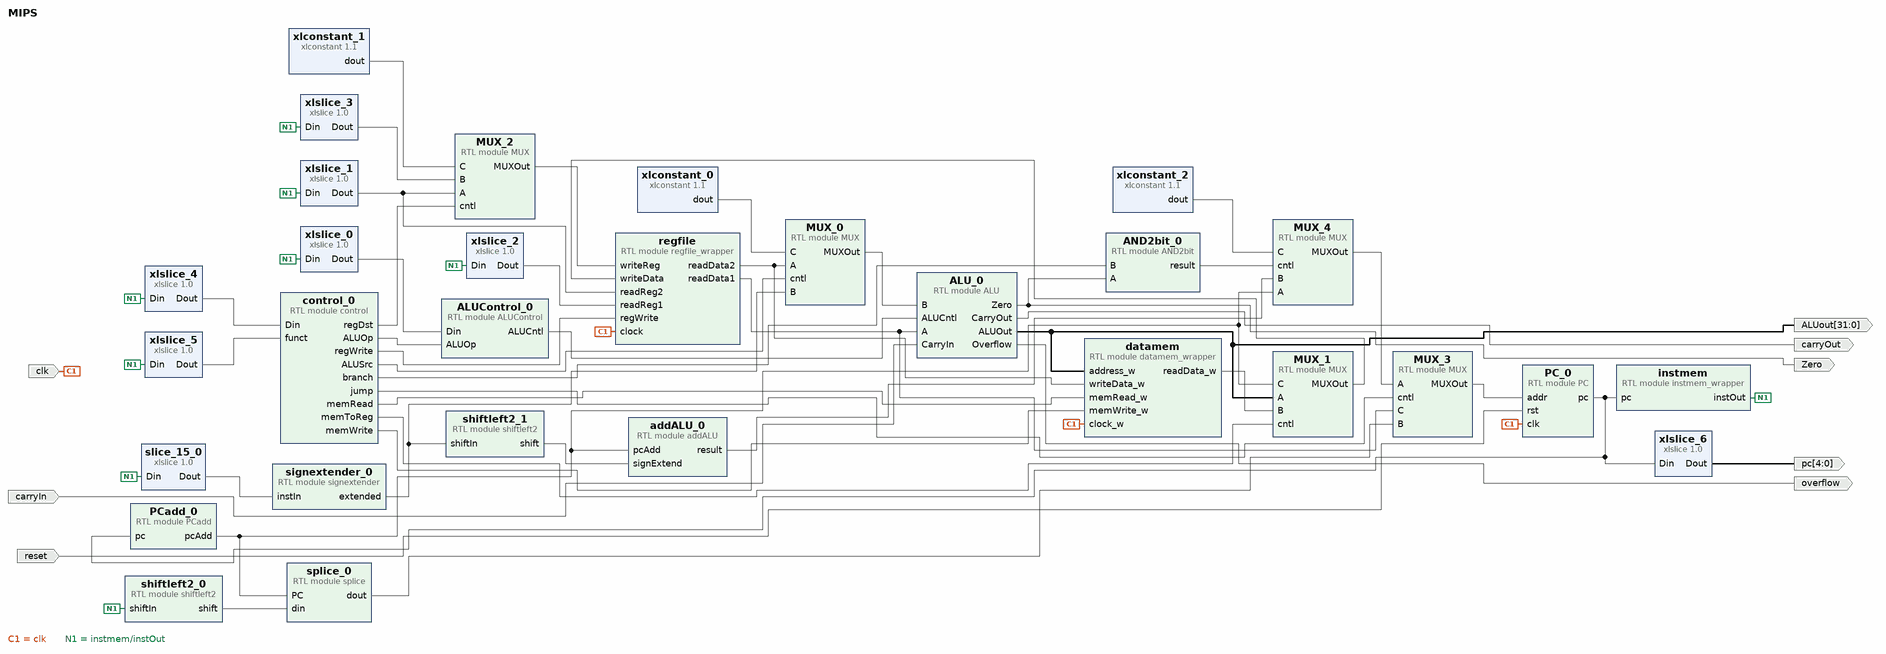
[diagram p0: block diagram of the top level]
# Vivado block design MIPS, xc7a35tcpg236-1, Vivado 2019.2
create_bd_design MIPS

create_bd_port -dir O -from 31 -to 0 ALUout
create_bd_port -dir O Zero
create_bd_port -dir I carryIn
create_bd_port -dir O carryOut
create_bd_port -dir I clk
create_bd_port -dir O overflow
create_bd_port -dir O -from 4 -to 0 pc
create_bd_port -dir I reset

create_bd_cell -type module -reference ALUControl ALUControl_0
create_bd_cell -type module -reference ALU ALU_0
create_bd_cell -type module -reference AND2bit AND2bit_0
create_bd_cell -type module -reference MUX MUX_0
create_bd_cell -type module -reference MUX MUX_1
create_bd_cell -type module -reference MUX MUX_2
set_property -dict {CONFIG.BUS_WIDTH 5} [get_bd_cells MUX_2]
create_bd_cell -type module -reference MUX MUX_3
create_bd_cell -type module -reference MUX MUX_4
create_bd_cell -type module -reference PC PC_0
create_bd_cell -type module -reference PCadd PCadd_0
create_bd_cell -type module -reference addALU addALU_0
create_bd_cell -type module -reference control control_0
create_bd_cell -type module -reference instmem_wrapper instmem
create_bd_cell -type module -reference regfile_wrapper regfile
create_bd_cell -type module -reference shiftleft2 shiftleft2_0
create_bd_cell -type module -reference shiftleft2 shiftleft2_1
create_bd_cell -type module -reference signextender signextender_0
create_bd_cell -type ip -vlnv xilinx.com:ip:xlslice:1.0 slice_15_0
set_property -dict {CONFIG.DIN_FROM 15 CONFIG.DOUT_WIDTH 16} [get_bd_cells slice_15_0]
create_bd_cell -type module -reference splice splice_0
create_bd_cell -type ip -vlnv xilinx.com:ip:xlconstant:1.1 xlconstant_0
set_property -dict {CONFIG.CONST_VAL 0 CONFIG.CONST_WIDTH 32} [get_bd_cells xlconstant_0]
create_bd_cell -type ip -vlnv xilinx.com:ip:xlconstant:1.1 xlconstant_1
set_property -dict {CONFIG.CONST_VAL 31 CONFIG.CONST_WIDTH 5} [get_bd_cells xlconstant_1]
create_bd_cell -type ip -vlnv xilinx.com:ip:xlconstant:1.1 xlconstant_2
set_property -dict {CONFIG.CONST_VAL 0 CONFIG.CONST_WIDTH 32} [get_bd_cells xlconstant_2]
create_bd_cell -type ip -vlnv xilinx.com:ip:xlslice:1.0 xlslice_0
set_property -dict {CONFIG.DIN_FROM 5 CONFIG.DOUT_WIDTH 6} [get_bd_cells xlslice_0]
create_bd_cell -type ip -vlnv xilinx.com:ip:xlslice:1.0 xlslice_1
set_property -dict {CONFIG.DIN_FROM 20 CONFIG.DIN_TO 16 CONFIG.DOUT_WIDTH 5} [get_bd_cells xlslice_1]
create_bd_cell -type ip -vlnv xilinx.com:ip:xlslice:1.0 xlslice_2
set_property -dict {CONFIG.DIN_FROM 25 CONFIG.DIN_TO 21 CONFIG.DOUT_WIDTH 5} [get_bd_cells xlslice_2]
create_bd_cell -type ip -vlnv xilinx.com:ip:xlslice:1.0 xlslice_3
set_property -dict {CONFIG.DIN_FROM 15 CONFIG.DIN_TO 11 CONFIG.DOUT_WIDTH 5} [get_bd_cells xlslice_3]
create_bd_cell -type ip -vlnv xilinx.com:ip:xlslice:1.0 xlslice_4
set_property -dict {CONFIG.DIN_FROM 31 CONFIG.DIN_TO 26 CONFIG.DOUT_WIDTH 6} [get_bd_cells xlslice_4]
create_bd_cell -type ip -vlnv xilinx.com:ip:xlslice:1.0 xlslice_5
set_property -dict {CONFIG.DIN_FROM 5 CONFIG.DOUT_WIDTH 6} [get_bd_cells xlslice_5]
create_bd_cell -type ip -vlnv xilinx.com:ip:xlslice:1.0 xlslice_6
set_property -dict {CONFIG.DIN_FROM 6 CONFIG.DIN_TO 2 CONFIG.DOUT_WIDTH 5} [get_bd_cells xlslice_6]
create_bd_cell -type module -reference datamem_wrapper datamem

# ---- connections ----

connect_bd_net [get_bd_pins ALUControl_0/ALUCntl] [get_bd_pins ALU_0/ALUCntl]
connect_bd_net [get_bd_pins ALU_0/ALUOut] [get_bd_ports ALUout] [get_bd_pins MUX_1/A] [get_bd_pins datamem/address_w]
connect_bd_net [get_bd_pins ALU_0/CarryOut] [get_bd_ports carryOut]
connect_bd_net [get_bd_pins ALU_0/Overflow] [get_bd_ports overflow]
connect_bd_net [get_bd_pins ALU_0/Zero] [get_bd_ports Zero] [get_bd_pins AND2bit_0/A]
connect_bd_net [get_bd_pins AND2bit_0/result] [get_bd_pins MUX_4/cntl]
connect_bd_net [get_bd_pins MUX_0/MUXOut] [get_bd_pins ALU_0/B]
connect_bd_net [get_bd_pins MUX_1/MUXOut] [get_bd_pins regfile/writeData]
connect_bd_net [get_bd_pins MUX_2/MUXOut] [get_bd_pins regfile/writeReg]
connect_bd_net [get_bd_pins MUX_3/MUXOut] [get_bd_pins PC_0/addr]
connect_bd_net [get_bd_pins MUX_4/MUXOut] [get_bd_pins MUX_3/A]
connect_bd_net [get_bd_pins PC_0/pc] [get_bd_pins instmem/pc] [get_bd_pins PCadd_0/pc] [get_bd_pins xlslice_6/Din]
connect_bd_net [get_bd_pins PCadd_0/pcAdd] [get_bd_pins MUX_1/C] [get_bd_pins splice_0/PC] [get_bd_pins MUX_4/A] [get_bd_pins addALU_0/pcAdd]
connect_bd_net [get_bd_pins addALU_0/result] [get_bd_pins MUX_4/B]
connect_bd_net [get_bd_ports carryIn] [get_bd_pins ALU_0/CarryIn]
connect_bd_net [get_bd_ports clk] [get_bd_pins regfile/clock] [get_bd_pins PC_0/clk] [get_bd_pins datamem/clock_w]
connect_bd_net [get_bd_pins control_0/ALUOp] [get_bd_pins ALUControl_0/ALUOp]
connect_bd_net [get_bd_pins control_0/ALUSrc] [get_bd_pins MUX_0/cntl]
connect_bd_net [get_bd_pins control_0/branch] [get_bd_pins AND2bit_0/B]
connect_bd_net [get_bd_pins control_0/jump] [get_bd_pins MUX_3/cntl]
connect_bd_net [get_bd_pins control_0/memRead] [get_bd_pins datamem/memRead_w]
connect_bd_net [get_bd_pins control_0/memToReg] [get_bd_pins MUX_1/cntl]
connect_bd_net [get_bd_pins control_0/memWrite] [get_bd_pins datamem/memWrite_w]
connect_bd_net [get_bd_pins control_0/regDst] [get_bd_pins MUX_2/cntl]
connect_bd_net [get_bd_pins control_0/regWrite] [get_bd_pins regfile/regWrite]
connect_bd_net -net datamem_wrapper_0_readData_w [get_bd_pins datamem/readData_w] [get_bd_pins MUX_1/B]
connect_bd_net -net instmem_wrapper_0_instOut [get_bd_pins instmem/instOut] \
  [get_bd_pins xlslice_0/Din] [get_bd_pins xlslice_1/Din] [get_bd_pins xlslice_2/Din] [get_bd_pins xlslice_3/Din] \
  [get_bd_pins xlslice_4/Din] [get_bd_pins xlslice_5/Din] [get_bd_pins slice_15_0/Din] [get_bd_pins shiftleft2_0/shiftIn]
connect_bd_net -net regfile_wrapper_0_readData1 [get_bd_pins regfile/readData1] [get_bd_pins ALU_0/A] [get_bd_pins MUX_3/C]
connect_bd_net -net regfile_wrapper_0_readData2 [get_bd_pins regfile/readData2] [get_bd_pins MUX_0/A] [get_bd_pins datamem/writeData_w]
connect_bd_net [get_bd_ports reset] [get_bd_pins PC_0/rst]
connect_bd_net [get_bd_pins shiftleft2_0/shift] [get_bd_pins splice_0/din]
connect_bd_net [get_bd_pins shiftleft2_1/shift] [get_bd_pins addALU_0/signExtend]
connect_bd_net [get_bd_pins signextender_0/extended] [get_bd_pins MUX_0/B] [get_bd_pins shiftleft2_1/shiftIn]
connect_bd_net [get_bd_pins splice_0/dout] [get_bd_pins MUX_3/B]
connect_bd_net [get_bd_pins xlconstant_0/dout] [get_bd_pins MUX_0/C]
connect_bd_net [get_bd_pins xlconstant_1/dout] [get_bd_pins MUX_2/C]
connect_bd_net [get_bd_pins xlconstant_2/dout] [get_bd_pins MUX_4/C]
connect_bd_net [get_bd_pins xlslice_0/Dout] [get_bd_pins ALUControl_0/Din]
connect_bd_net [get_bd_pins xlslice_1/Dout] [get_bd_pins regfile/readReg2] [get_bd_pins MUX_2/A]
connect_bd_net [get_bd_pins xlslice_2/Dout] [get_bd_pins regfile/readReg1]
connect_bd_net [get_bd_pins xlslice_3/Dout] [get_bd_pins MUX_2/B]
connect_bd_net [get_bd_pins xlslice_4/Dout] [get_bd_pins control_0/Din]
connect_bd_net [get_bd_pins xlslice_5/Dout] [get_bd_pins control_0/funct]
connect_bd_net [get_bd_pins xlslice_6/Dout] [get_bd_ports pc]
connect_bd_net [get_bd_pins slice_15_0/Dout] [get_bd_pins signextender_0/instIn]

validate_bd_design
save_bd_design
